# Altium schematic sheet H21R4_Frontend.SchDoc
size Letter; CompanyName: Hexabitz; DocumentNumber: 3; SheetNumber: 2; SheetTotal: 2
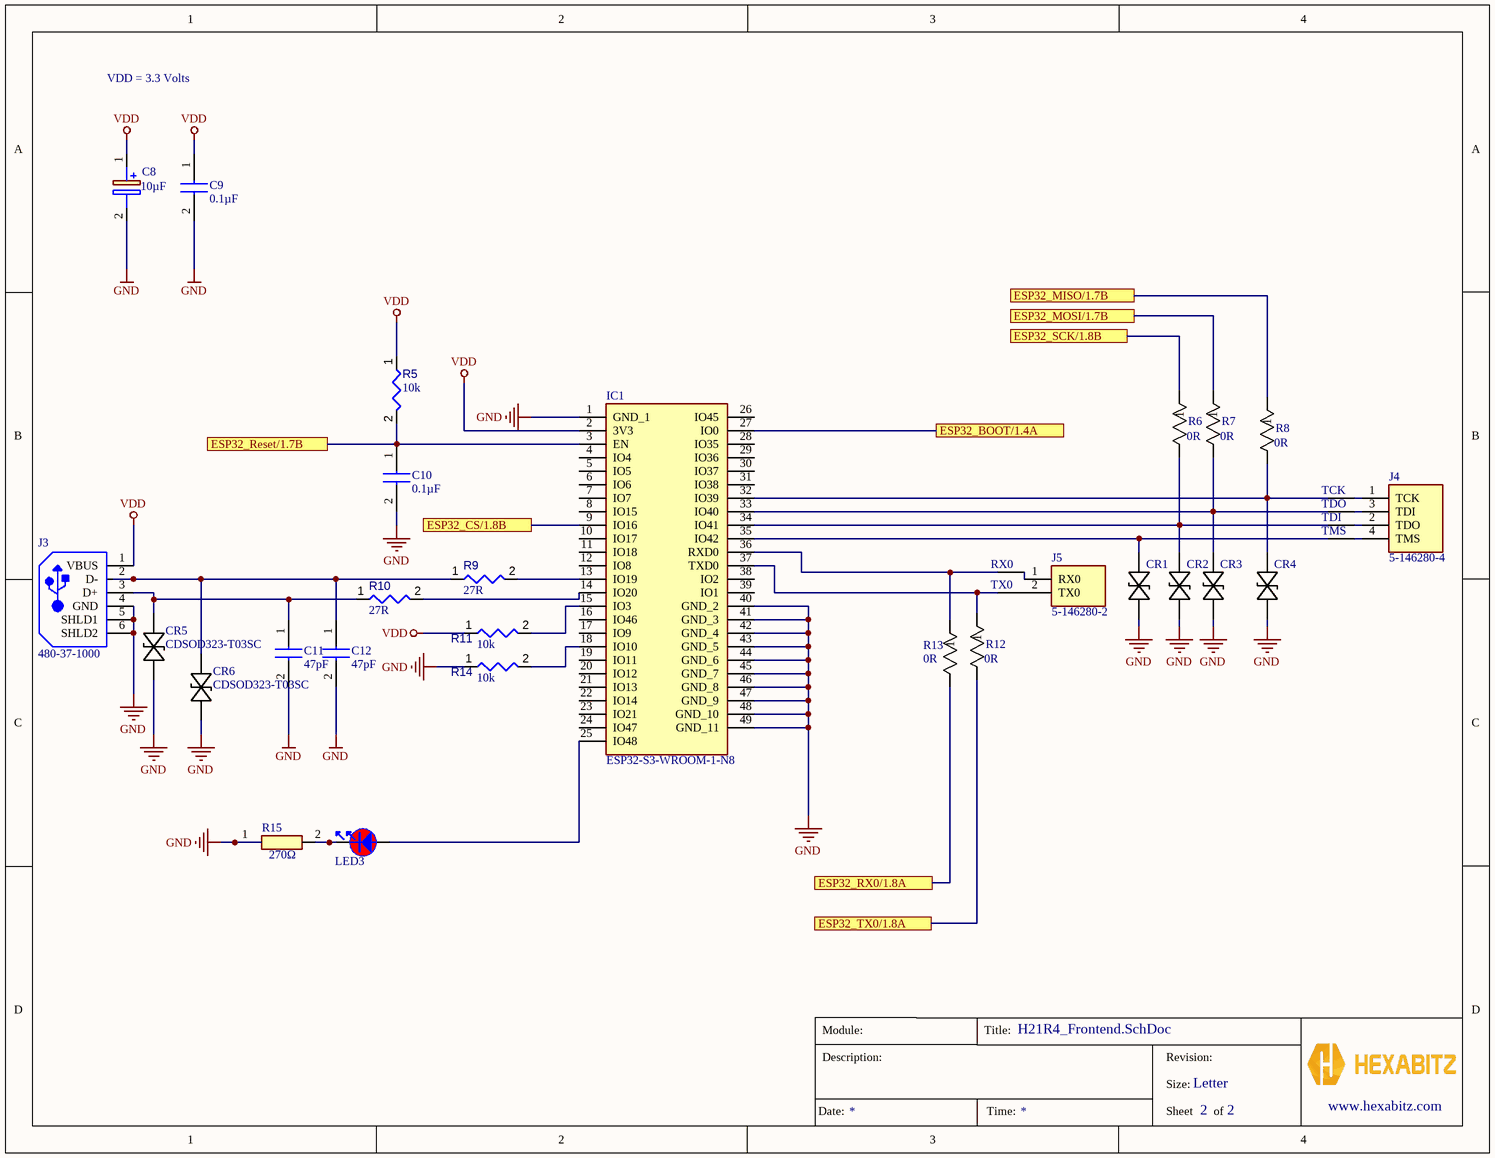
[diagram p0: H21R4_Frontend.SchDoc]

## Parts
C8  value 10µF  [CAPPM3528X210N]  (hidden comment: TPSB106K016R0500)
C9  value 0.1µF  [CAPC1608X87N]  (hidden comment: C0603C104K8RAC7867)
C10  value 0.1µF  [CAPC1608X87N]  (hidden comment: C0603C104K8RAC7867)
C11  value 47pF  [CAPC1608X90N]  (hidden comment: CL10C470JB8NNNC)
C12  value 47pF  [CAPC1608X90N]  (hidden comment: CL10C470JB8NNNC)
CR1  CDSOD323-T03SC  [SOD-323_BRN]  (value not drawn)
CR2  CDSOD323-T03SC  [SOD-323_BRN]  (value not drawn)
CR3  CDSOD323-T03SC  [SOD-323_BRN]  (value not drawn)
CR4  CDSOD323-T03SC  [SOD-323_BRN]  (value not drawn)
CR5  CDSOD323-T03SC  [SOD-323_BRN]
CR6  CDSOD323-T03SC  [SOD-323_BRN]
IC1  ESP32-S3-WROOM-1-N8  [ESP32S3WROOM1N8R2]
J3  480-37-1000  [MOLX-480-37-1000_V]
J4  5-146280-4  [HDRV4W77P254_4X1_467X488X821P]
J5  5-146280-2  [HDRV2W77P0X254_1X2_467X234X872P]
LED3  VLMS1300-GS08  [FP-6_541-5092_01-4-MFG]  (value not drawn)
R5  value 10k  [CAPC1508X06N]  (hidden comment: RMCF0603JT10K0)
R6  value 0R  [YAG_AC0402_YAG]  (hidden comment: AC0402JR-070RL)
R7  value 0R  [YAG_AC0402_YAG]  (hidden comment: AC0402JR-070RL)
R8  value 0R  [YAG_AC0402_YAG]  (hidden comment: AC0402JR-070RL)
R9  value 27R  [CAPC1608X06N]  (hidden comment: ERJ-3GEYJ270V)
R10  value 27R  [CAPC1608X06N]  (hidden comment: ERJ-3GEYJ270V)
R11  value 10k  [CAPC1508X06N]  (hidden comment: RMCF0603JT10K0)
R12  value 0R  [YAG_AC0402_YAG]  (hidden comment: AC0402JR-070RL)
R13  value 0R  [YAG_AC0402_YAG]  (hidden comment: AC0402JR-070RL)
R14  value 10k  [CAPC1508X06N]  (hidden comment: RMCF0603JT10K0)
R15  value 270Ω  [ERJ3EKF1000V]  (hidden comment: ERJ-3GEYJ271V)
RX0  HEXABIT_UART_PORT  [HEXABIT_POWER_PORT_U]  (value not drawn)  (no BOM)
TCK  HEXABIT_UART_PORT  [HEXABIT_POWER_PORT_U]  (value not drawn)  (no BOM)
TDI  HEXABIT_UART_PORT  [HEXABIT_POWER_PORT_U]  (value not drawn)  (no BOM)
TDO  HEXABIT_UART_PORT  [HEXABIT_POWER_PORT_U]  (value not drawn)  (no BOM)
TMS  HEXABIT_UART_PORT  [HEXABIT_POWER_PORT_U]  (value not drawn)  (no BOM)
TX0  HEXABIT_UART_PORT  [HEXABIT_POWER_PORT_U]  (value not drawn)  (no BOM)

## Ports
ESP32_BOOT/1.4A, ESP32_CS/1.8B, ESP32_MISO/1.7B, ESP32_MOSI/1.7B, ESP32_Reset/1.7B, ESP32_RX0/1.8A, ESP32_SCK/1.8B, ESP32_TX0/1.8A

## Nets
GND: C8.2(-) C9.2 C10.2 C11.2 C12.2 CR1.2(ANODECATHODE_2) CR2.2(ANODECATHODE_2) CR3.2(ANODECATHODE_2) CR4.2(ANODECATHODE_2) CR5.2(ANODECATHODE_2) CR6.2(ANODECATHODE_2) IC1.1(GND_1) IC1.40(GND_2) IC1.41(GND_3) IC1.42(GND_4) IC1.43(GND_5) IC1.44(GND_6) IC1.45(GND_7) IC1.46(GND_8) IC1.47(GND_9) IC1.48(GND_10) IC1.49(GND_11) J3.4(GND) J3.5(SHLD1) J3.6(SHLD2) R14.1 R15.1
VDD: C8.1(+) C9.1 IC1.2(3V3) J3.1(VBUS) R5.1 R11.1
ESP32_BOOT/1.4A: IC1.27(IO0) ; port ESP32_BOOT/1.4A
ESP32_CS/1.8B: IC1.9(IO16) ; port ESP32_CS/1.8B
ESP32_MISO/1.7B: R8.1 ; port ESP32_MISO/1.7B
ESP32_MOSI/1.7B: R7.1 ; port ESP32_MOSI/1.7B
ESP32_Reset/1.7B: C10.1 IC1.3(EN) R5.2 ; port ESP32_Reset/1.7B
ESP32_RX0/1.8A: R13.2 ; port ESP32_RX0/1.8A
ESP32_SCK/1.8B: R6.1 ; port ESP32_SCK/1.8B
ESP32_TX0/1.8A: R12.2 ; port ESP32_TX0/1.8A
NetC11_1: C11.1 CR5.1(ANODECATHODE) J3.3(D+) R10.1
NetC12_1: C12.1 CR6.1(ANODECATHODE) J3.2(D-) R9.1
NetCR1_1: CR1.1(ANODECATHODE) IC1.35(IO42)
NetCR2_1: CR2.1(ANODECATHODE) IC1.34(IO41) R6.2
NetCR3_1: CR3.1(ANODECATHODE) IC1.33(IO40) R7.2
NetCR4_1: CR4.1(ANODECATHODE) IC1.32(IO39) R8.2
NetIC1_13: IC1.13(IO19) R9.2
NetIC1_14: IC1.14(IO20) R10.2
NetIC1_15: IC1.15(IO3) R11.2
NetIC1_18: IC1.18(IO10) R14.2
NetIC1_25: IC1.25(IO48) LED3.2
NetIC1_36: IC1.36(RXD0) R13.1
NetIC1_37: IC1.37(TXD0) R12.1
NetJ4_1: J4.1(TCK) TCK.Pwr_U
NetJ4_2: J4.2(TDO) TDI.Pwr_U
NetJ4_3: J4.3(TDI) TDO.Pwr_U
NetJ4_4: J4.4(TMS) TMS.Pwr_U
NetJ5_1: J5.1(RX0) RX0.Pwr_U
NetJ5_2: J5.2(TX0) TX0.Pwr_U
NetLED3_1: LED3.1 R15.2

Not connected (* = marked no-connect by the designer): IC1 4(IO4) 5(IO5) 6(IO6) 7(IO7) 8(IO15) 10(IO17) 11(IO18) 12(IO8) 16(IO46) 17(IO9) 19(IO11) 20(IO12) 21(IO13) 22(IO14) 23(IO21) 24(IO47) 26(IO45) 28(IO35) 29(IO36) 30(IO37) 31(IO38) 38(IO2) 39(IO1)

## Notes on the sheet
- VDD = 3.3 Volts
- Module:
- Title:
- Description:
- Size:
- Revision:
- Letter
- www.hexabitz.com
- Date:
- Time:
- Sheet
- of

## Library data of the parts
C8 = TPSB106K016R0500: Capacitor Polarised; Manufacturer_Name: Kyocera AVX; Datasheet Link: https://componentsearchengine.com/Datasheets/2/TPSB106K016R0500.pdf; Height: 2.1mm; Manufacturer_Part_Number: TPSB106K016R0500; Mouser Part Number: 581-TPSB106K016R0500; Mouser Price/Stock: https://www.mouser.co.uk/ProductDetail/KYOCERA-AVX/TPSB106K016R0500?qs=2Zc1E7vIw%252B6V4Ir4qQ11Ew%3D%3D; Arrow Part Number: TPSB106K016R0500; Arrow Price/Stock: https://www.arrow.com/en/products/tpsb106k016r0500/avx?utm_currency=USD&region=nac
C9 C10 = C0603C104K8RAC7867: Capacitor; Manufacturer_Name: KEMET; Datasheet Link: https://labcenter.componentsearchengine.com/Datasheets/1/C0603C104K8RAC7867.pdf; Height: 0.87mm; Manufacturer_Part_Number: C0603C104K8RAC7867; Mouser Part Number: N/A; Mouser Price/Stock: https://www.mouser.co.uk/ProductDetail/KEMET/C0603C104K8RAC7867?qs=DLNzJaHuXGcLxwK2qWBfDA%3D%3D; Arrow Part Number: C0603C104K8RAC7867; Arrow Price/Stock: https://www.arrow.com/en/products/c0603c104k8rac7867/kemet-corporation?region=nac
C11 C12 = CL10C470JB8NNNC: Capacitor; Manufacturer_Name: SAMSUNG; Datasheet Link: http://uk.rs-online.com/web/p/products/7665095; Height: 0.9mm; Manufacturer_Part_Number: CL10C470JB8NNNC; Mouser Part Number: 187-CL10C470JB8NNNC; Mouser Price/Stock: https://www.mouser.co.uk/ProductDetail/Samsung-Electro-Mechanics/CL10C470JB8NNNC?qs=349EhDEZ59pmluRkjzIjBw%3D%3D; Arrow Part Number: CL10C470JB8NNNC; Arrow Price/Stock: https://www.arrow.com/en/products/cl10c470jb8nnnc/samsung-electro-mechanics?region=nac
CR1-CR6 = CMP-009-000000-1: Description; Manufacturer_Name: Bourns Electronics; Design Item ID: CDSOD323-T03SC; Source: CDSOD323-T03SC.SchLib; Manufacturer_Part_Number: CDSOD323-T03SC; Copyright: Copyright (C) 2025 Ultra Librarian. All rights reserved.
IC1 = ESP32-S3-WROOM-1-N8: SMD MODULE, ESP32-S3, 8 MB SPI F; Manufacturer_Name: Espressif Systems; Datasheet Link: https://www.espressif.com/sites/default/files/documentation/esp32-s3-wroom-1_wroom-1u_datasheet_en.pdf; Height: 3.25mm; Manufacturer_Part_Number: ESP32-S3-WROOM-1-N8; Mouser Part Number: 356-ESP32-S3WROOM1N8; Mouser Price/Stock: https://www.mouser.co.uk/ProductDetail/Espressif-Systems/ESP32-S3-WROOM-1-N8?qs=Wj%2FVkw3K%252BMC1mq0KGPvoSQ%3D%3D
J3 = CMP-002-00040-2: Universal Serial Bus (USB) Shielded I/O Plug, Type A, Right Angle Connector, 4 Position, Height 4.6 mm, -20 to 85 degC, RoHS, Tray; Manufacturer: Molex; Gender: Male; Voltage Rating (AC): 150V; Max Current Rating: 1.5A; Package Description: 4-Pin Surface Mount Device, Body 12 x 18.8 mm; Max Operating Temperature: 85°C; Mounting Technology: SM; Contact Material: Brass; Case/Package: 480-37-1000; Connector Type: USB; Contact Plating: Gold; RoHS Compliant: True; Colour: Black; Datasheet URL: http://www.molex.com/pdm_docs/sd/480371000_sd.pdf; Manufacturer URL: http://www.molex.com/; Max Voltage Rating (AC): 150V; Datasheet Version: Rev. D, 06/2004; Current Rating: 1.5A; Min Operating Temperature: -20°C; Pins: 4; Package Reference: 480-37-1000; Packaging: Tray
J4 = CMP-002-00113-1: TE Connectivity Mod II Series, 2.54mm Pitch 4 Way 1 Row Straight PCB Header, Through Hole Termination; Geometry.Height: 8.21mm; Manufacturer_Name: TE Connectivity; Design Item ID: 5-146280-4; Source: 5-146280-4.SchLib; Newark Part Number: *; Datasheet Link: https://datasheet.datasheetarchive.com/originals/distributors/DKDS-20/396066.pdf; Manufacturer_Part_Number: 5-146280-4; Newark Price/Stock: *
J5 = CMP-057-000000-1: Body Features: Primary Product Color Black; Manufacturer_Name: TE Connectivity; Geometry.Height: 8.72mm; Datasheet Link: http://www.te.com/commerce/DocumentDelivery/DDEController?Action=showdoc&DocId=Customer+Drawing%7F146280%7FH2%7Fpdf%7FEnglish%7FENG_CD_146280_H2.pdf%7F5-146280-2; Arrow Price/Stock: https://www.arrow.com/en/products/5-146280-2/te-connectivity?utm_currency=USD&region=europe; Manufacturer_Part_Number: 5-146280-2; Design Item ID: 5-146280-2; Mouser Part Number: 571-5-146280-2; Mouser Price/Stock: https://www.mouser.co.uk/ProductDetail/TE-Connectivity/5-146280-2?qs=bwpFY26eRVcxHP%252BQexhLNQ%3D%3D; Arrow Part Number: 5-146280-2; Source: 5-146280-2.SchLib
LED3 = CMP-007-00039-1: LED Uni-Color Super Red 639nm 2-Pin Chip 0603(1608Metric) T/R; Manufacturer: Vishay Semiconductors; Lens Style: Rectangular,Clear; Forward Current: 20mA; Luminous Intensity: 54mcd; Number of LEDs: 1; Power Rating: 75mW; Library: Hexabitz; Dominant Wavelength: 631nm; Viewing Angle: 130°; Forward Voltage: 2V; Height: 0.8mm; Design Item ID: VLMS1300-GS08; ComponentLink3Description: https://datasheet.ciiva.com/9333/vlmo1300-9333743.pdf?src-supplier=Avnet; ComponentLink6URL: https://datasheet.ciiva.com/2114/vlmo1300-2114931.pdf?src-supplier=Digikey; Width: 0.8mm; Category: LEDs; ComponentLink1URL: https://datasheet.ciiva.com/26322/vlmo1300-26322153.pdf?src-supplier=Element14; ComponentLink3URL: https://datasheet.ciiva.com/9333/vlmo1300-9333743.pdf?src-supplier=Avnet; Lead Free: Lead Free; ComponentLink5Description: https://datasheet.ciiva.com/2114/vlmo1300-2114930.pdf?src-supplier=Digikey; ComponentLink7Description: https://datasheet.ciiva.com/2114/vlmo1300-2114929.pdf?src-supplier=Digikey; Min Operating Temperature: -35°C; Stock: 56745; Test Current: 20mA; Length: 1.6mm; Case Code (Metric): 1608; Series: CHipLED; Mounting Technology: Surface Mount; Color: Red; Manufacturer Part Number: VLMS1300-GS08; ComponentLink5URL: https://datasheet.ciiva.com/2114/vlmo1300-2114930.pdf?src-supplier=Digikey; Source: Semiconductor.SchLib; Radiation Hardening: No; ComponentLink7URL: https://datasheet.ciiva.com/2114/vlmo1300-2114929.pdf?src-supplier=Digikey; ComponentLink2URL: https://datasheet.ciiva.com/8028/vlmo1300-8028047.pdf?src-supplier=Element14; Pricing: 1=0.21, 10=0.143, 100=0.0998, 500=0.07982, 1000=0.07322 (USD); Wavelength: 631nm; Illumination Color: Red; ComponentLink6Description: https://datasheet.ciiva.com/2114/vlmo1300-2114931.pdf?src-supplier=Digikey; Case/Package: 0603; Reach SVHC Compliant: Unknown; RoHS Compliant: Yes; ComponentLink2Description: https://datasheet.ciiva.com/8028/vlmo1300-8028047.pdf?src-supplier=Element14; ComponentLink4URL: https://datasheet.ciiva.com/16510/vlmo1300-16510985.pdf?src-supplier=Future+Electronics; Max Operating Temperature: 85°C; Pins: 2; RoHS: Yes; ComponentLink1Description: https://datasheet.ciiva.com/26322/vlmo1300-26322153.pdf?src-supplier=Element14; ComponentLink4Description: https://datasheet.ciiva.com/16510/vlmo1300-16510985.pdf?src-supplier=Future+Electronics; Packaging: Tape and Reel; Component Type: Standard; Package Quantity: 1
R5 R11 R14 = CMP-009-00177-1: Res Thick Film 0603 10K Ohm 5% 1/10W ±200ppm/°C Molded SMD Paper T/R; Voltage Rating: 75V; Tolerance: 5%; Max Operating Temperature: 155°C; Min Operating Temperature: -55°C; Case/Package: 0603; Mounting Technology: Surface Mount
R6-R8 R12 R13 = CMP-009-00179-1: No Description Available; Manufacturer_Name: Yageo; Copyright: Copyright (C) 2025 Ultra Librarian. All rights reserved.; Manufacturer_Part_Number: AC0402JR-070RL; Source: AC0402JR-070RL.SchLib; Design Item ID: AC0402JR-070RL
R9 R10 = CMP-009-00178-1: Res Thick Film 0603 27 Ohm 5% 1/10W +/-200ppm/ßC Molded SMD Punched Carrier T/R; Voltage Rating: 75V; Mounting Technology: Surface Mount; Max Operating Temperature: 155°C; Case/Package: 0603; Tolerance: 5%; Min Operating Temperature: -55°C
R15 = ERJ-3GEYJ271V: Resistor; Manufacturer_Name: Panasonic; Datasheet Link: http://docs-europe.electrocomponents.com/webdocs/13ba/0900766b813ba21b.pdf; Height: 0.55mm; Manufacturer_Part_Number: ERJ-3GEYJ271V; Mouser Part Number: 667-ERJ-3GEYJ271V; Mouser Price/Stock: https://www.mouser.co.uk/ProductDetail/Panasonic/ERJ-3GEYJ271V?qs=gUVpg3Fu0g%2FL9W%252BXBtc%252BCA%3D%3D; Arrow Part Number: ERJ-3GEYJ271V; Arrow Price/Stock: https://www.arrow.com/en/products/erj-3geyj271v/panasonic?region=nac
RX0 TCK TDI TDO TMS TX0 = HEXABIT_POWER_PORT_U